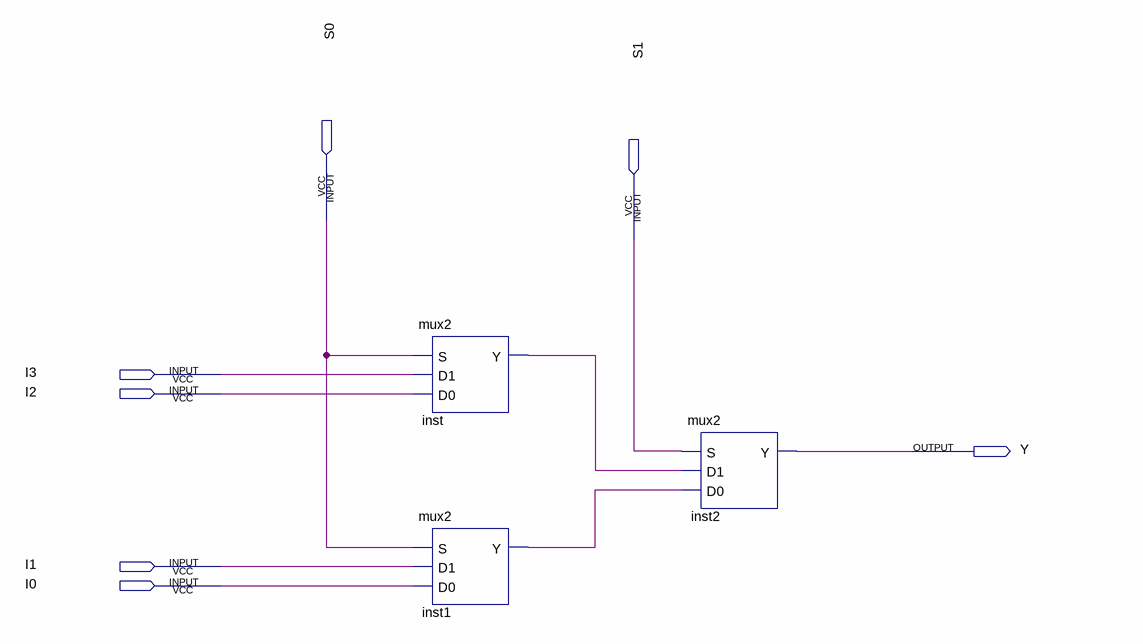
[diagram p0: schematic sheet]
// Quartus schematic mux4.bdf as structural Verilog: 3 symbols, 7 pins
module mux4 (
  input  S0,
  input  S1,
  input  I3,
  input  I2,
  input  I1,
  input  I0,
  output Y
);

  wire inst1_y, inst_y;

  mux2 inst (.S(S0), .D1(I3), .D0(I2), .Y(inst_y));
  mux2 inst1 (.S(S0), .D1(I1), .D0(I0), .Y(inst1_y));
  mux2 inst2 (.S(S1), .D1(inst_y), .D0(inst1_y), .Y(Y));
endmodule
